# Altium schematic sheet FluidNC_Controller_Sheet_1.SchDoc: {Наименование одна строка}
size 420 x 297 mm; SheetNumber: 2; SheetTotal: 2; Title1str: {Наименование}; PageSetup: Record=PageOptions|CenterHorizontal=False|CenterVertical=False|PrintScale=0.33|XCorrection=0.00|YCorrection=0.00|PrintKind=1|BorderSize=5000000|LeftOffset=0|BottomOffset=0|Orientation=1|PaperLength=1000|PaperWidth=1000|Scale=100|PaperSource=15|PrintQuality=600|MediaType=1|DitherType=10|PaperKind=A4|PrintScaleMode=1; Title2str: {Наименование}; DocumentType: Схема электрическая принципиальная; ImagePath: {Перв. применение}; Rule: PcbType=ProtelPcb
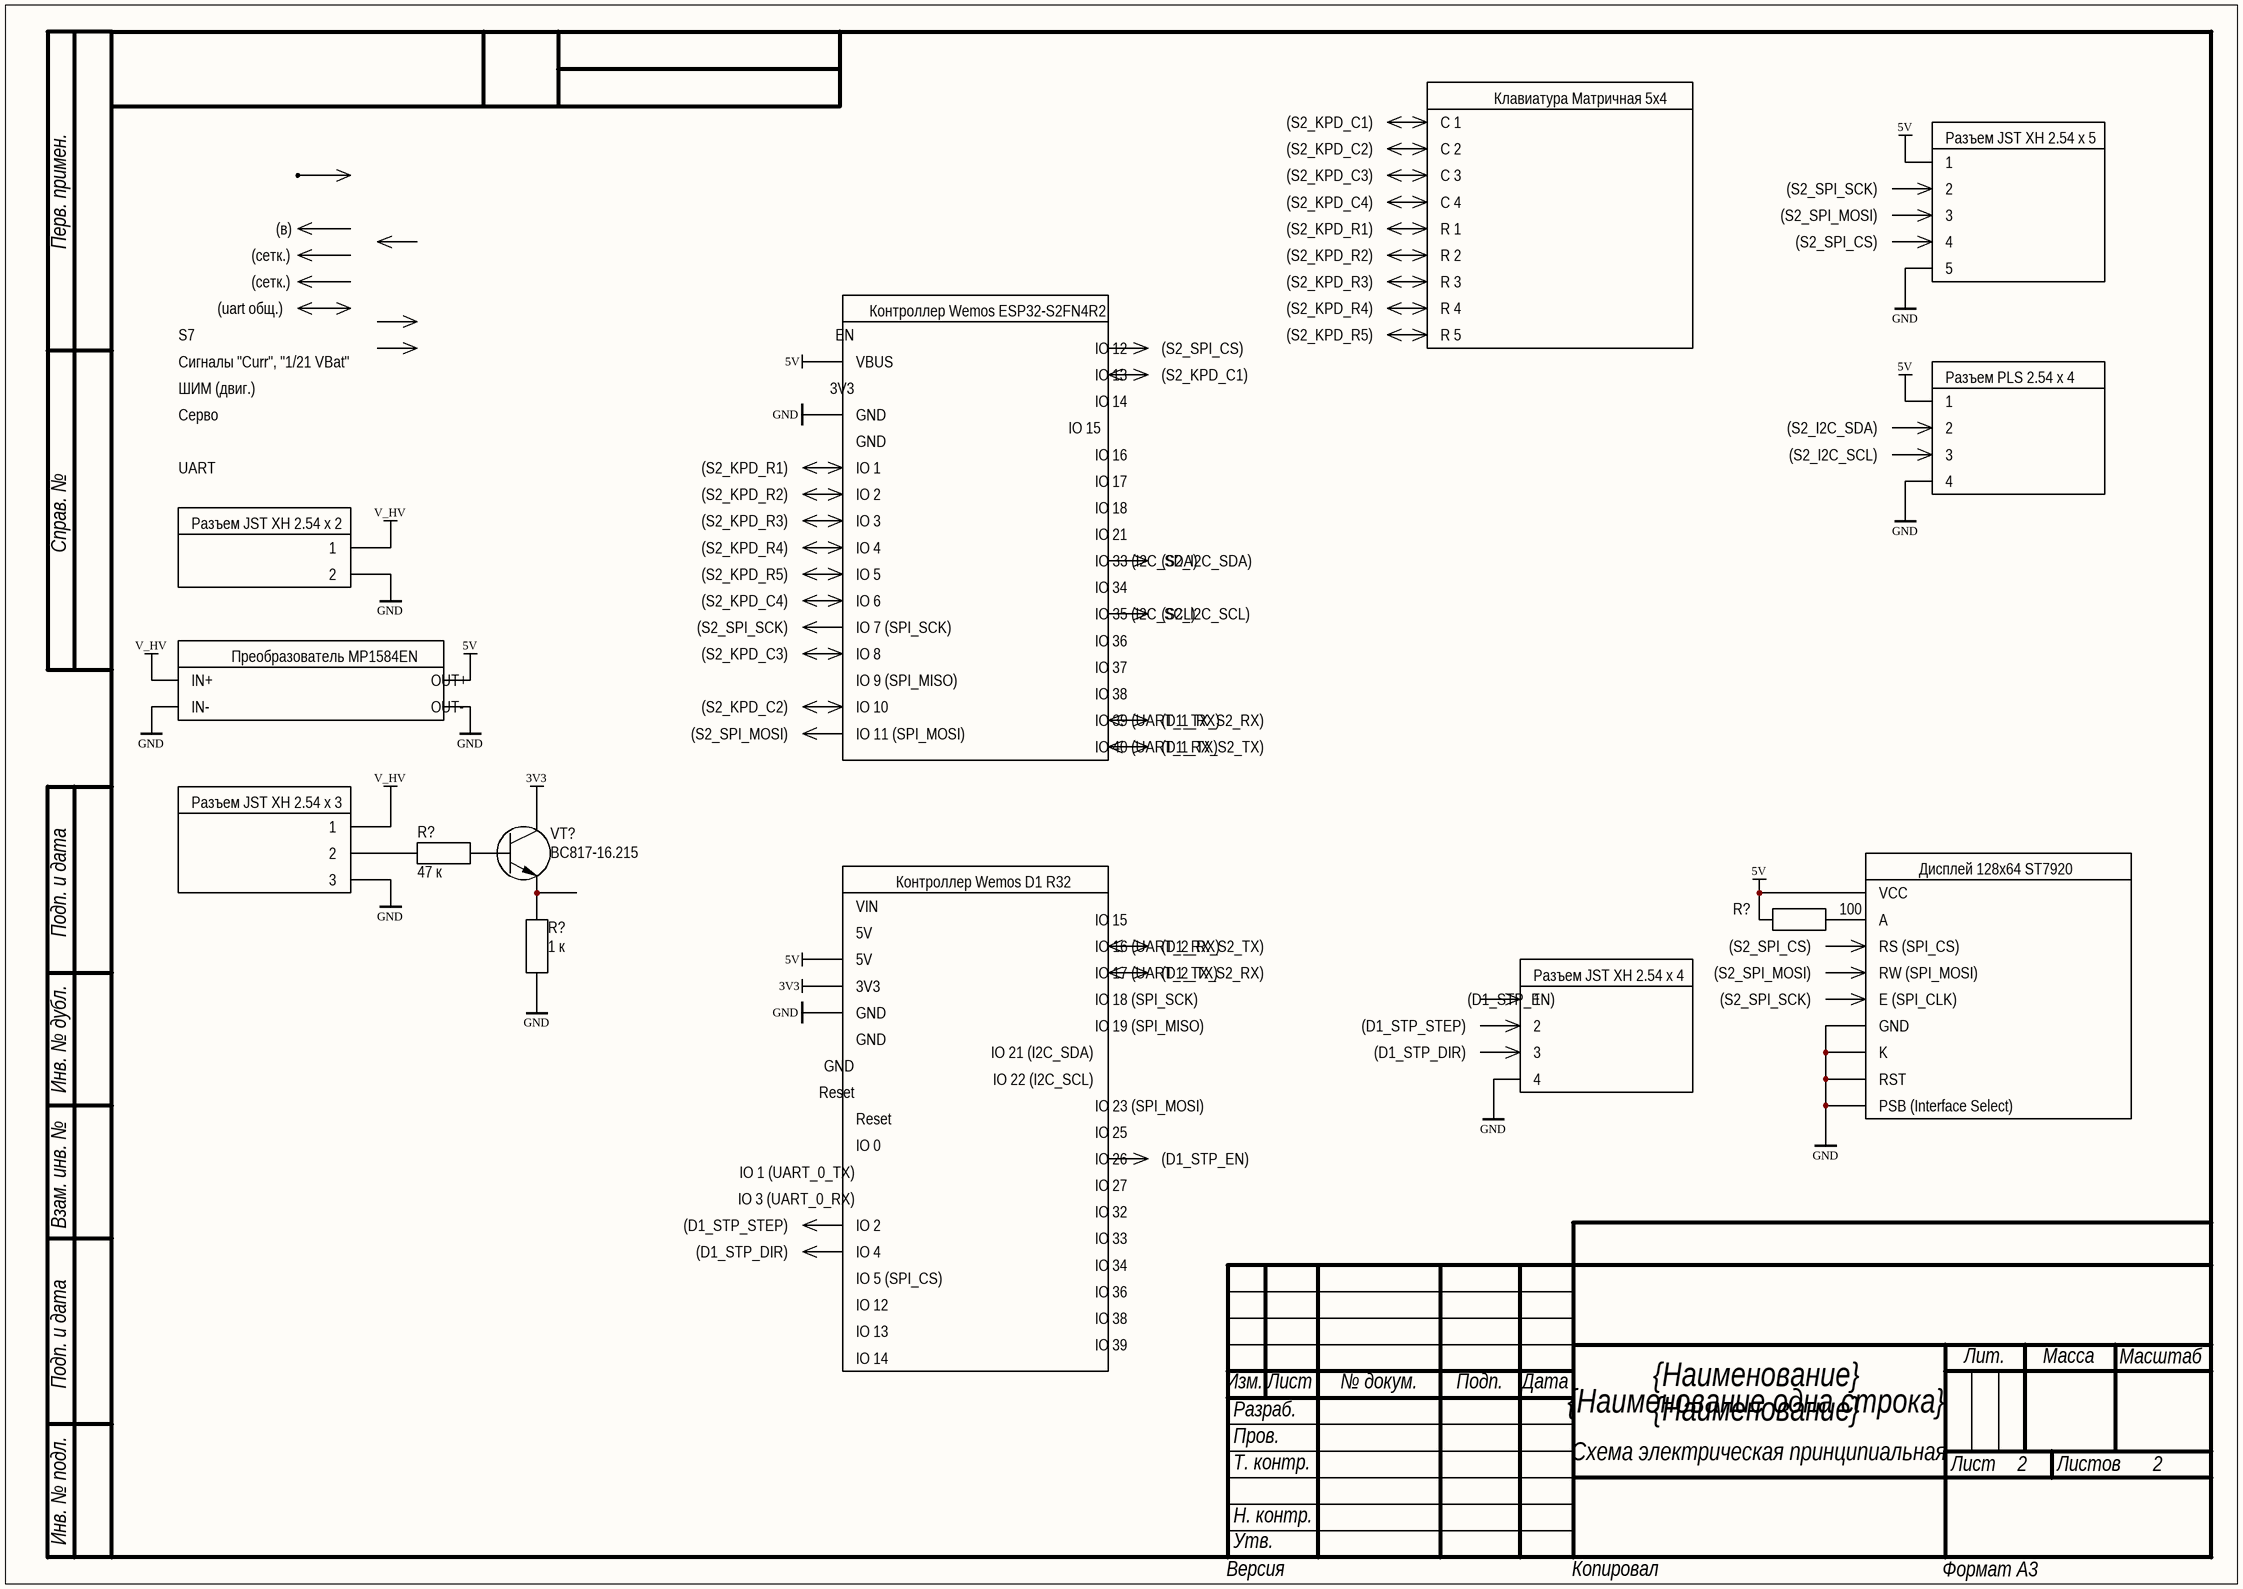
[diagram p0: FluidNC_Controller_Sheet_1.SchDoc]

## Parts
(Parts that share a designator on the sheet are numbered #1, #2 ... from top to bottom, then left to right.)
A?#1  Клавиатура Матричная 5х4
A?#2  Разъем JST XH 2.54 x 5
A?#3  Контроллер Wemos ESP32-S2FN4R2
A?#4  Разъем PLS 2.54 x 4
A?#5  Разъем JST XH 2.54 x 2
A?#6  Преобразователь MP1584EN
A?#7  Разъем JST XH 2.54 x 3
A?#8  Дисплей 128x64 ST7920
A?#9  Контроллер Wemos D1 R32
A?#10  Разъем JST XH 2.54 x 4
R?#1  value 47 к  [CH0603R]  (hidden comment: RC0603FR-0747KL)
R?#2  value 100  [CH1206R]  (hidden comment: RC1206JR-07100RL)
R?#3  value 1 к  [CH0603R]  (hidden comment: RC0603FR-071KL)
VT?  BC817-16.215  [SOT23_123]

## Nets
3V3: VT?.2(C)
5V: R?#2.1
GND: R?#3.1
NetR?#1_2: R?#1.2 VT?.1(B)
NetR?#3_2: R?#3.2 VT?.3(E)

Not connected (* = marked no-connect by the designer): R?#1 1; R?#2 2

## Notes on the sheet
- (S2_KPD_C1)
- С 1
- (S2_KPD_C2)
- (S2_KPD_C3)
- С 2
- С 3
- (S2_SPI_SCK)
- 1
- 2
- (сетк.)
- (в)
- (S2_KPD_C4)
- (S2_KPD_R1)
- (S2_KPD_R2)
- С 4
- R 1
- R 2
- (S2_SPI_CS)
- (S2_SPI_MOSI)
- 3
- 4
- S7
- (uart общ.)
- EN
- (S2_KPD_R3)
- (S2_KPD_R4)
- (S2_KPD_R5)
- R 3
- R 4
- R 5
- 5
- Сигналы "Curr", "1/21 VBat"
- ШИМ (двиг.)
- VBUS
- 3V3
- IO 12
- IO 13
- IO 14
- UART
- Серво
- GND
- IO 1
- IO 15
- IO 16
- (S2_I2C_SDA)
- (S2_I2C_SCL)
- IO 2
- IO 3
- IO 18
- IO 21
- IO 17
- IO 4
- IO 5
- IO 6
- IO 33 (I2C_SDA)
- IO 34
- IO 7 (SPI_SCK)
- IO 8
- IO 37
- IO 35 (I2C_SCL)
- IO 36
- IN+
- IN-
- OUT+
- OUT-
- IO 9 (SPI_MISO)
- IO 10
- IO 11 (SPI_MOSI)
- IO 39 (UART_1_RX)
- IO 38
- (D1_TX_S2_RX)
- IO 40 (UART_1_TX)
- (D1_RX_S2_TX)
- 5V
- VIN
- VCC
- (near R?#2) A
- IO 18 (SPI_SCK)
- IO 16 (UART_2_RX)
- IO 17 (UART_2_TX)
- (D1_STP_EN)
- (near R?#2) (S2_SPI_CS)
- (near R?#2) (S2_SPI_MOSI)
- RW (SPI_MOSI)
- RS (SPI_CS)
- E (SPI_CLK)
- IO 21 (I2C_SDA)
- IO 19 (SPI_MISO)
- (D1_STP_STEP)
- (D1_STP_DIR)
- K
- Reset
- IO 22 (I2C_SCL)
- IO 23 (SPI_MOSI)
- IO 25
- PSB (Interface Select)
- RST
- IO 0
- IO 1 (UART_0_TX)
- IO 3 (UART_0_RX)
- IO 32
- IO 27
- IO 26
- IO 5 (SPI_CS)
- IO 33
- IO 39
- Перв. примен.
- Справ. №
- Подп. и дата
- Инв. № дубл.
- Взам. инв. №
- Изм.
- Лист
- № докум.
- Подп.
- Дата
- Лит.
- Масса
- Масштаб
- Пров.
- Т. контр.
- Разраб.
- Листов
- Инв. № подл.
- Н. контр.
- Версия
- Утв.
- Копировал
- Формат А3

## Library data of the parts
A?#1-A?#10 = CMP-ROOT-0839-2: Device; Manufacturer: *; Case: *; Temperature: *
  A?#1: Family: Клавиатура; HelpURL: https://www.ozon.ru/product/matrichnaya-klaviatura-5-x-4-1574240323; Model: Матричная 5х4
  A?#2: Family: Разъем; HelpURL: https://www.ozon.ru/product/nabor-razemov-xh2-54-v-bokse-560sht-413034248; Model: JST XH 2.54 x 5
  A?#3: Family: Контроллер; HelpURL: https://taggsm.ru/index.php?route=product/product&path=13000040_13000065&product_id=119866; Model: Wemos ESP32-S2FN4R2
  A?#4: Family: Разъем; HelpURL: https://www.ozon.ru/product/nabor-razemov-xh2-54-v-bokse-560sht-413034248; Model: PLS 2.54 x 4
  A?#5: Family: Разъем; HelpURL: https://www.ozon.ru/product/nabor-razemov-xh2-54-v-bokse-560sht-413034248; Model: JST XH 2.54 x 2
  A?#6: Family: Преобразователь; HelpURL: https://taggsm.ru/index.php?route=product/product&path=13000040_13000041&product_id=112110; Model: MP1584EN
  A?#7: Family: Разъем; HelpURL: https://www.ozon.ru/product/nabor-razemov-xh2-54-v-bokse-560sht-413034248; Model: JST XH 2.54 x 3
  A?#8: Family: Дисплей; HelpURL: https://taggsm.ru/index.php?route=product/product&path=13000040_13000068&product_id=112842; Model: 128x64 ST7920
  A?#9: Family: Контроллер; HelpURL: https://taggsm.ru/index.php?route=product/product&path=13000040_13000065&product_id=119893; Model: Wemos D1 R32
  A?#10: Family: Разъем; HelpURL: https://www.ozon.ru/product/nabor-razemov-xh2-54-v-bokse-560sht-413034248; Model: JST XH 2.54 x 4
R?#1 = CMP-001-0077-9: Chip Resistor, Thick Film, 0603, 47 kOhm +/- 1%, 0.1 W, 75 V / 150 V, -55 C ... 155 C, +/- 100 PPM/C; Manufacturer: Yageo; Power: 0,1; Vnom_Vmax: 75_150; Tolerance: 1; Weight: 2 m; HelpURL: https://www.digikey.com/product-detail/en/yageo/RC0603FR-0749R9L/311-49.9HRTR-ND/727264; Case: 0603; Model: RC0603FR-0747KL; Family: Резистор; Temperature: -55 ...155
R?#2 = CMP-ROOT-0331-8: Chip Resistor, Thick Film, 1206, 100 Ohm +/- 5%, 0.25 W, 200 V / 400 V, -55 C ... 155 C, +/- 100 PPM/C; Manufacturer: Yageo; Vnom_Vmax: 200_400; Power: 0,25; Tolerance: 5; Weight: 16,2 m; Temperature: -55 ...155; Case: 1206; HelpURL: https://ru.mouser.com/ProductDetail/Yageo/RC1206JR-07100RL?qs=afJZr%2F7kGG7feudZTJCmlw%3D%3D; Model: RC1206JR-07100RL; Family: Резистор
R?#3 = CMP-0001-00000-18: Chip Resistor, Thick Film, 0603, 1 kOhm +/- 1%, 0.1 W, 75 V / 150 V, -55 C ... 155 C, +/- 100 PPM/C; Manufacturer: Yageo; Vnom_Vmax: 75_150; Power: 0,1; Tolerance: 1; Model: RC0603FR-071KL; HelpURL: https://www.digikey.com/product-detail/en/yageo/RC0603FR-071KL/311-1.00KHRTR-ND/726843; Weight: 2 m; Temperature: -55 ...155; Family: Резистор; Case: 0603
VT? = CMP-003-0017-7: Транзистор NPN 45В 0.5А 0.31Вт [SOT-23]; Manufacturer: NXP Semiconductor; Analog: BCX19LT1G, BC817-40, BCX19.215; Family: Транзистор; HelpURL: https://www.chipdip.ru/product/bc817-16-nxp; Temperature: -55..150; Model: BC817-16.215; Case: SOT-23-3; Type: NPN